# EAGLE schematic xio (EAGLE 9.1.0), part 2 of 2
## Sheet 16 of 16: FPGA Bank3
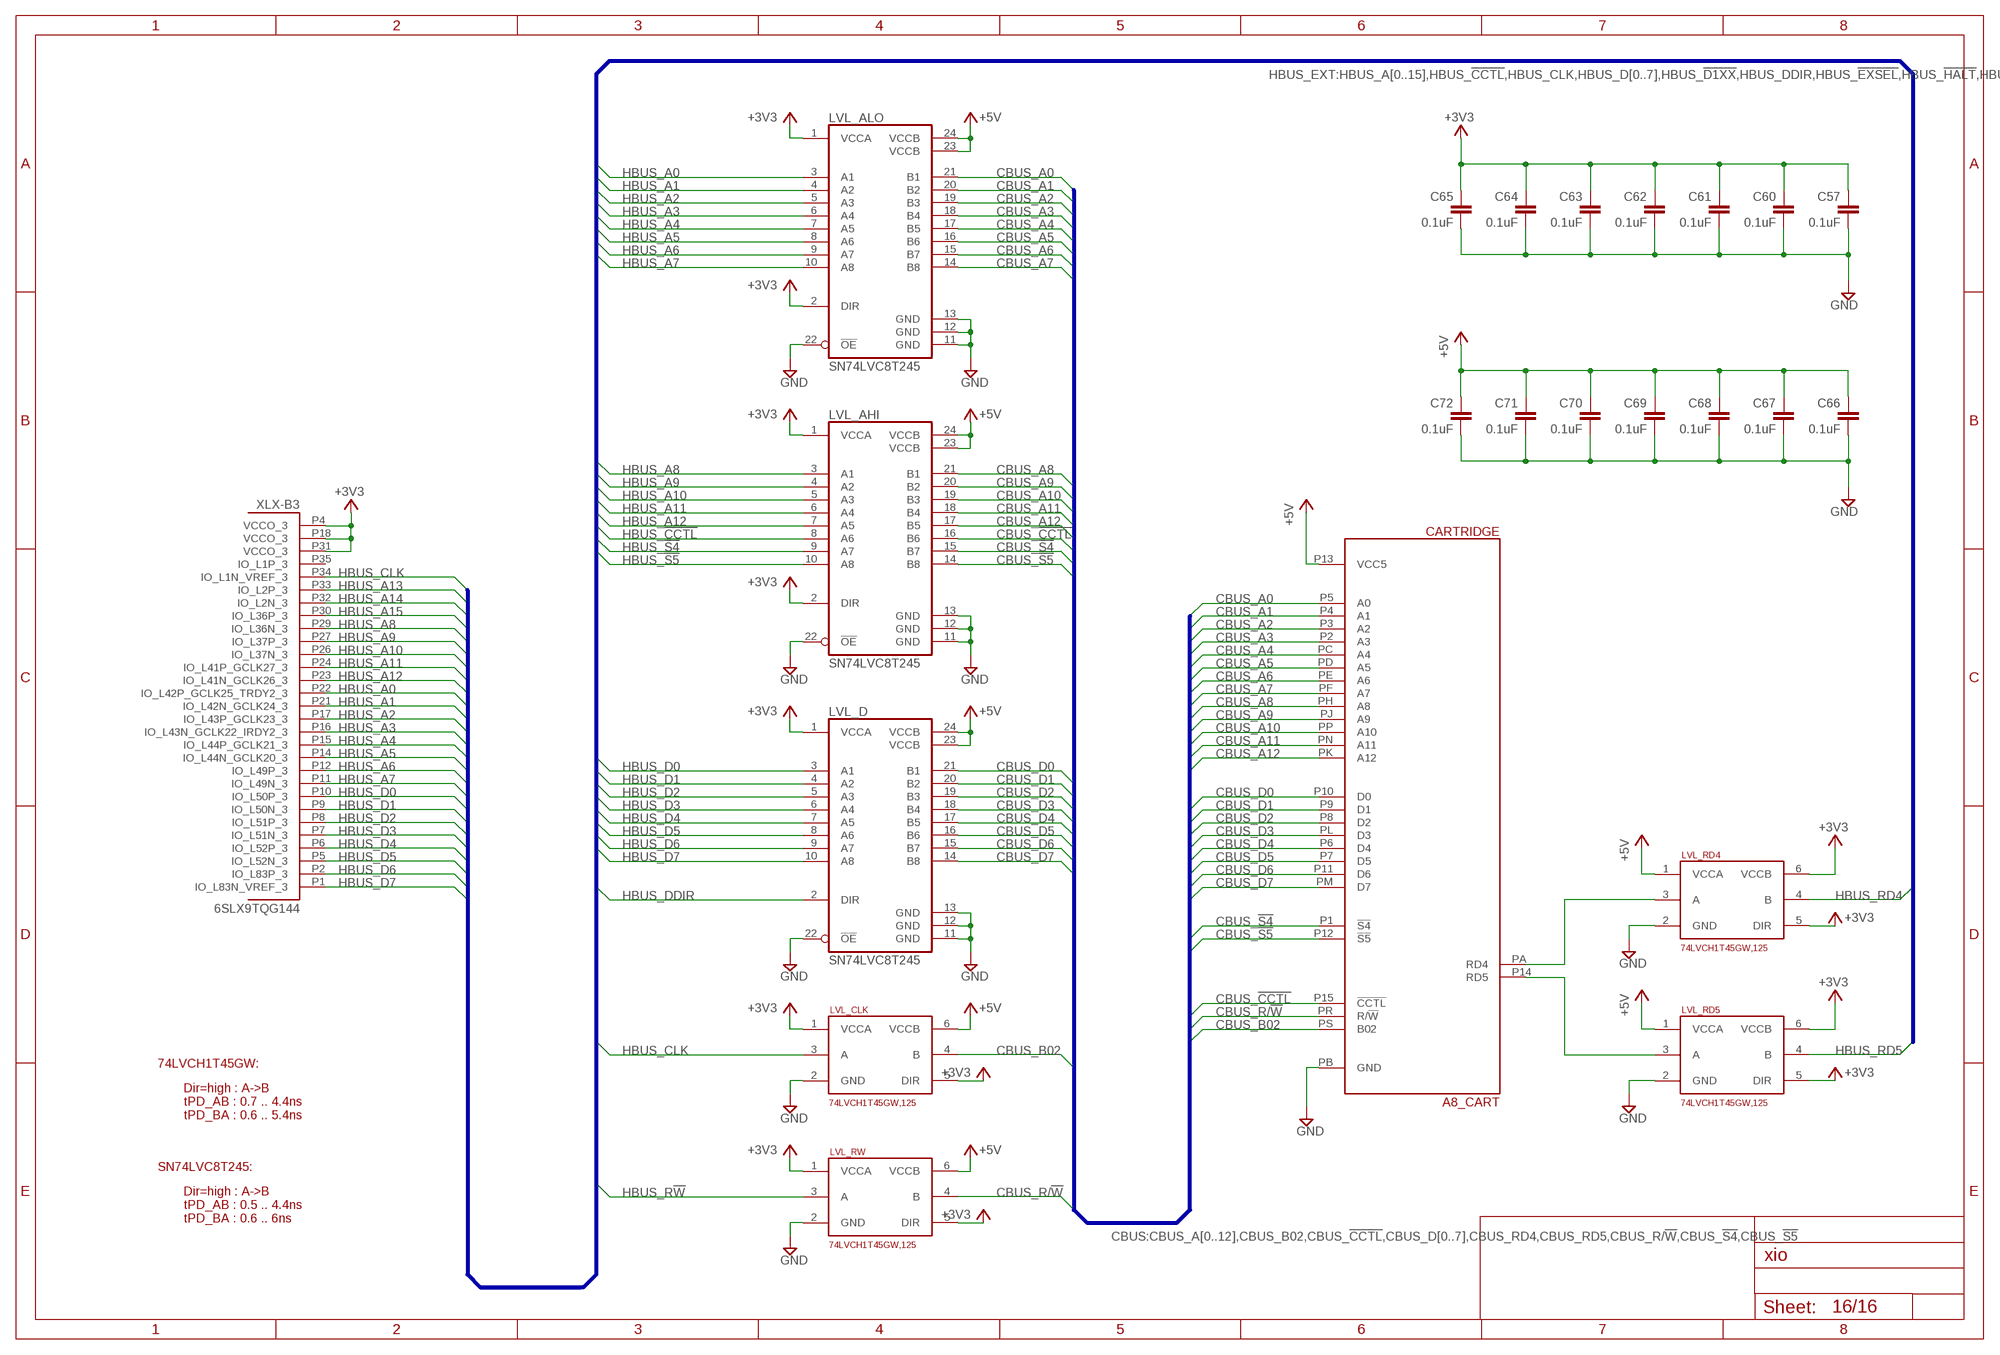
[diagram p18: schematic, sheet 16]

### Parts
C57  0.1uF  C-EUC0402K  [C0402K]
C60  0.1uF  C-EUC0402K  [C0402K]
C61  0.1uF  C-EUC0402K  [C0402K]
C62  0.1uF  C-EUC0402K  [C0402K]
C63  0.1uF  C-EUC0402K  [C0402K]
C64  0.1uF  C-EUC0402K  [C0402K]
C65  0.1uF  C-EUC0402K  [C0402K]
C66  0.1uF  C-EUC0402K  [C0402K]
C67  0.1uF  C-EUC0402K  [C0402K]
C68  0.1uF  C-EUC0402K  [C0402K]
C69  0.1uF  C-EUC0402K  [C0402K]
C70  0.1uF  C-EUC0402K  [C0402K]
C71  0.1uF  C-EUC0402K  [C0402K]
C72  0.1uF  C-EUC0402K  [C0402K]
CARTRIDGE  A8_CART  [A8_CART]
LVL_AHI  SN74LVC8T245  [TSSOP24]
LVL_ALO  SN74LVC8T245  [TSSOP24]
LVL_CLK  74LVCH1T45GW,125  74LVC1T45GW,125  [SOT363]
LVL_D  SN74LVC8T245  [TSSOP24]
LVL_RD4  74LVCH1T45GW,125  74LVC1T45GW,125  [SOT363]
LVL_RD5  74LVCH1T45GW,125  74LVC1T45GW,125  [SOT363]
LVL_RW  74LVCH1T45GW,125  74LVC1T45GW,125  [SOT363]

### Nets
+3V3 [3v3]: C57.1 C60.1 C61.1 C62.1 C63.1 C64.1 C65.1 LVL_AHI.1(VCCA) LVL_AHI.2(DIR) LVL_ALO.1(VCCA) LVL_ALO.2(DIR) LVL_CLK.1(VCCA) LVL_CLK.5(DIR) LVL_D.1(VCCA) LVL_RD4.5(DIR) LVL_RD4.6(VCCB) LVL_RD5.5(DIR) LVL_RD5.6(VCCB) LVL_RW.1(VCCA) LVL_RW.5(DIR) XLX-.P4(B3:VCCO_3) XLX-.P18(B3:VCCO_3) XLX-.P31(B3:VCCO_3) ; also sheet 2,4,5,6,11,12,13,14,15
+5V: C66.1 C67.1 C68.1 C69.1 C70.1 C71.1 C72.1 CARTRIDGE.P13(VCC5) LVL_AHI.23(VCCB) LVL_AHI.24(VCCB) LVL_ALO.23(VCCB) LVL_ALO.24(VCCB) LVL_CLK.6(VCCB) LVL_D.23(VCCB) LVL_D.24(VCCB) LVL_RD4.1(VCCA) LVL_RD5.1(VCCA) LVL_RW.6(VCCB) ; also sheet 2,7,8,9,10,11
CBUS_!CCTL!: CARTRIDGE.P15(!CCTL!) LVL_AHI.16(B6)
CBUS_!S4!: CARTRIDGE.P1(!S4!) LVL_AHI.15(B7)
CBUS_!S5!: CARTRIDGE.P12(!S5!) LVL_AHI.14(B8)
CBUS_A0: CARTRIDGE.P5(A0) LVL_ALO.21(B1)
CBUS_A1: CARTRIDGE.P4(A1) LVL_ALO.20(B2)
CBUS_A2: CARTRIDGE.P3(A2) LVL_ALO.19(B3)
CBUS_A3: CARTRIDGE.P2(A3) LVL_ALO.18(B4)
CBUS_A4: CARTRIDGE.PC(A4) LVL_ALO.17(B5)
CBUS_A5: CARTRIDGE.PD(A5) LVL_ALO.16(B6)
CBUS_A6: CARTRIDGE.PE(A6) LVL_ALO.15(B7)
CBUS_A7: CARTRIDGE.PF(A7) LVL_ALO.14(B8)
CBUS_A8: CARTRIDGE.PH(A8) LVL_AHI.21(B1)
CBUS_A9: CARTRIDGE.PJ(A9) LVL_AHI.20(B2)
CBUS_A10: CARTRIDGE.PP(A10) LVL_AHI.19(B3)
CBUS_A11: CARTRIDGE.PN(A11) LVL_AHI.18(B4)
CBUS_A12: CARTRIDGE.PK(A12) LVL_AHI.17(B5)
CBUS_B02: CARTRIDGE.PS(B02) LVL_CLK.4(B)
CBUS_D0: CARTRIDGE.P10(D0) LVL_D.21(B1)
CBUS_D1: CARTRIDGE.P9(D1) LVL_D.20(B2)
CBUS_D2: CARTRIDGE.P8(D2) LVL_D.19(B3)
CBUS_D3: CARTRIDGE.PL(D3) LVL_D.18(B4)
CBUS_D4: CARTRIDGE.P6(D4) LVL_D.17(B5)
CBUS_D5: CARTRIDGE.P7(D5) LVL_D.16(B6)
CBUS_D6: CARTRIDGE.P11(D6) LVL_D.15(B7)
CBUS_D7: CARTRIDGE.PM(D7) LVL_D.14(B8)
CBUS_R/!W!: CARTRIDGE.PR(R/!W!) LVL_RW.4(B)
GND: C57.2 C60.2 C61.2 C62.2 C63.2 C64.2 C65.2 C66.2 C67.2 C68.2 C69.2 C70.2 C71.2 C72.2 CARTRIDGE.PB(GND) LVL_AHI.11(GND) LVL_AHI.12(GND) LVL_AHI.13(GND) LVL_AHI.22(!OE!) LVL_ALO.11(GND) LVL_ALO.12(GND) LVL_ALO.13(GND) LVL_ALO.22(!OE!) LVL_CLK.2(GND) LVL_D.11(GND) LVL_D.12(GND) LVL_D.13(GND) LVL_D.22(!OE!) LVL_RD4.2(GND) LVL_RD5.2(GND) LVL_RW.2(GND) ; also sheet 2,4,5,6,7,8,9,10,11,12,13,14,15
HBUS_!CCTL!: LVL_AHI.8(A6) ; also sheet 15
HBUS_!S4!: LVL_AHI.9(A7) ; also sheet 15
HBUS_!S5!: LVL_AHI.10(A8) ; also sheet 15
HBUS_A0: LVL_ALO.3(A1) XLX-.P22(B3:IO_L42P_GCLK25_TRDY2_3) ; also sheet 8,9,10
HBUS_A1: LVL_ALO.4(A2) XLX-.P21(B3:IO_L42N_GCLK24_3) ; also sheet 8,9,10
HBUS_A2: LVL_ALO.5(A3) XLX-.P17(B3:IO_L43P_GCLK23_3) ; also sheet 8,9,10
HBUS_A3: LVL_ALO.6(A4) XLX-.P16(B3:IO_L43N_GCLK22_IRDY2_3) ; also sheet 8,9,10
HBUS_A4: LVL_ALO.7(A5) XLX-.P15(B3:IO_L44P_GCLK21_3) ; also sheet 8,9,10
HBUS_A5: LVL_ALO.8(A6) XLX-.P14(B3:IO_L44N_GCLK20_3) ; also sheet 8,9,10
HBUS_A6: LVL_ALO.9(A7) XLX-.P12(B3:IO_L49P_3) ; also sheet 8,9,10
HBUS_A7: LVL_ALO.10(A8) XLX-.P11(B3:IO_L49N_3) ; also sheet 8,9,10
HBUS_A8: LVL_AHI.3(A1) XLX-.P29(B3:IO_L36N_3) ; also sheet 8,9,10
HBUS_A9: LVL_AHI.4(A2) XLX-.P27(B3:IO_L37P_3) ; also sheet 8,9,10
HBUS_A10: LVL_AHI.5(A3) XLX-.P26(B3:IO_L37N_3) ; also sheet 8,9,10
HBUS_A11: LVL_AHI.6(A4) XLX-.P24(B3:IO_L41P_GCLK27_3) ; also sheet 8,9,10
HBUS_A12: LVL_AHI.7(A5) XLX-.P23(B3:IO_L41N_GCLK26_3) ; also sheet 8,9,10
HBUS_A13: XLX-.P33(B3:IO_L2P_3) ; also sheet 8,9,10
HBUS_A14: XLX-.P32(B3:IO_L2N_3) ; also sheet 8,9,10
HBUS_A15: XLX-.P30(B3:IO_L36P_3) ; also sheet 8,9,10
HBUS_CLK: LVL_CLK.3(A) XLX-.P34(B3:IO_L1N_VREF_3) ; also sheet 8,9,10
HBUS_D0: LVL_D.3(A1) XLX-.P10(B3:IO_L50P_3) ; also sheet 8,9,10
HBUS_D1: LVL_D.4(A2) XLX-.P9(B3:IO_L50N_3) ; also sheet 8,9,10
HBUS_D2: LVL_D.5(A3) XLX-.P8(B3:IO_L51P_3) ; also sheet 8,9,10
HBUS_D3: LVL_D.6(A4) XLX-.P7(B3:IO_L51N_3) ; also sheet 8,9,10
HBUS_D4: LVL_D.7(A5) XLX-.P6(B3:IO_L52P_3) ; also sheet 8,9,10
HBUS_D5: LVL_D.8(A6) XLX-.P5(B3:IO_L52N_3) ; also sheet 8,9,10
HBUS_D6: LVL_D.9(A7) XLX-.P2(B3:IO_L83P_3) ; also sheet 8,9,10
HBUS_D7: LVL_D.10(A8) XLX-.P1(B3:IO_L83N_VREF_3) ; also sheet 8,9,10
HBUS_DDIR: LVL_D.2(DIR) ; also sheet 14
HBUS_R!W!: LVL_RW.3(A) ; also sheet 8,9,10,15
HBUS_RD4: LVL_RD4.4(B) ; also sheet 8,9,10,15
HBUS_RD5: LVL_RD5.4(B) ; also sheet 8,9,10,15
N$58: CARTRIDGE.PA(RD4) LVL_RD4.3(A)
N$59: CARTRIDGE.P14(RD5) LVL_RD5.3(A)
Unconnected: XLX-.P35(B3:IO_L1P_3)

### Buses
HBUS_EXT:HBUS_A[0..15],HBUS_!CCTL!,HBUS_CLK,HBUS_D[0..7],HBUS_!D1XX!,HBUS_DDIR,HBUS_!EXSEL!,HBUS_!HALT!,HBUS_!IRQ!,HBUS_!MPD!,HBUS_RD[4..5],HBUS_!REF!,HBUS_!RST!,HBUS_R!W!,HBUS_!S4!,HBUS_!S5!,HBUS_SIO_CLK,HBUS_SIO_CMD,HBUS_SIO_DIN,HBUS_SIO_DOUT,HBUS_SIO_MTR
CBUS:CBUS_A[0..12],CBUS_B02,CBUS_!CCTL!,CBUS_D[0..7],CBUS_RD4,CBUS_RD5,CBUS_R/!W!,CBUS_!S4!,CBUS_!S5!

### Notes on the sheet
- 74LVCH1T45GW:
- Dir=high : A->B
  tPD_AB : 0.7 .. 4.4ns
  tPD_BA : 0.6 .. 5.4ns
- SN74LVC8T245:
- Dir=high : A->B
  tPD_AB : 0.5 .. 4.4ns
  tPD_BA : 0.6 .. 6ns

## Library data of the parts
A_MUX = sjg-logic:TS3A27518E
ARCH_ID = special:SW_DIP-4: DIP SWITCH
AUX-SIO = pinhead:PINHD-1X6: PIN HEADER
C1-C98 C134-C137 C167-C175 C177 = rcl:C-EU: CAPACITOR, European symbol; SPICEPREFIX: C
CARTRIDGE = sjg-con:A8_CART
D1-D5 = diode:BAT54S: Schottky Diodes Pin connection corrected 2011-05-04 Source: Fairchild .. BAT54.pdf
DBG0 DBG1 DBG2 FPGA_DONE = microbuilder:LED: LED 0603 - 0603 Surface Mount Package 2mA: Green LED - Low Power (3.9mcd, 2ma, 1.7Vf) - Digikey: 475-2709-2-ND Orange LED - Low Power (9.8mcd, 2ma, 1.8Vf) - Digikey: 475-1194-2-ND Red LED - Low Power (5mcd, 2ma, 1.8Vf) - Digikey: 475-1195-2-ND Yellow LED - Low Power (7mcd, 2ma, 1.8Vf) - Digikey: 475-1196-2-ND 5mA: Blue LED - Low Power (17mcd, 5ma, 2.9Vf) - Digikey: LNJ937W8CRACT-ND 0805 - 0805 Surface Mount Package 2mA: Red LED (8.8mcd, 2mA, 1.8Vf, Clear) - Low Power [Digikey: 475-2510-1-ND] Green LED (5mcd, 2mA, 1.8Vf, Clear) - Low Power [Digikey: 475-2730-1-ND] Yellow LED (11.3mcd, 2mA, 1.8Vf, Clear) - Low Power [Digikey: 475-2555-1-ND] 20mA: Red LED (104mcd, 20mA, Diffused) - LS R976 [Digikey: 475-1278-6-ND] Red LED (12mcd, 20mA, 2.0Vf, Clear) - APT2012EC [Digikey: 754-1128-1-ND] Green LED (15mcd, 20mA, 2.2Vf, Clear) - APT2012GC [Digikey: 754-1131-1-ND] Orange LED (160mcd, 20mA, 2.1Vf, Clear) - APT2012SECK [Digikey: 754-1130-1-ND] 1206 - 1206 Surface Mount Package Green LED (26mcd, 20mA, Diffused) - LG N971 [Digikey: 475-1407-6-ND] Red LED (15mcd, 20mA, Diffused) - LH N974 [Digikey: 475-1416-6-ND]
FPGA_CFG = microbuilder:SPIFLASH_SOIC8: SOIC8 SPI Flash Be careful with the size since SOIC8 flash comes in several 'widths' SOIC8 150 mil M25P16 - 16Mbit (2Mbit x 8) Serial Flash (75MHz SPI Bus), Supply: 2.7-3.6V Digikey: SOIC8 - M25P16-VMN6P-ND SOIC8 208 mil W25Q16BVSSIG - 16Mbit (2Mbit x 8) Serial Flash (104MHz SPI Bus), Supply: 2.7-3.6V Digikey: SOIC8 - W25Q16BVSSIG-ND
FPGA_PROG = sjg-con:XILINX-JTAG
H1 H2 H4 H5 = holes:MOUNT-HOLE: MOUNTING HOLE with drill center marker
J1 = usb-c:12401598E4#2A: Usb Jack 3.1, C Type, 24 Pin, Ho; AVAILABILITY: Unavailable; DESCRIPTION: Usb Type C / Tape & Reel; MF: Amphenol Commercial; MP: 12401598E4#2A; PACKAGE: None; PRICE: None
JP1 = pinhead:PINHD-2X8: PIN HEADER
JP2 = pinhead:PINHD-2X7: PIN HEADER
LVL_AHI LVL_ALO LVL_D = sjg-logic:SN74LVC8T245
LVL_CLK LVL_RD4 LVL_RD5 LVL_RW = sjg-logic:74LVC1T45GW,125
MEM_ID = special:SW_DIP-2: DIP SWITCH
OSC1 = microbuilder:OSCILLATOR: Oscillators 3.2x2.5mm SMT 4.0MHz +/- 50ppm, 3.3V, 9mA, -40/+85°C - Digikey: 535-9752-1-ND 50MHz +/- 50ppm, 3.3V, 8mA, -10/+70°C - Digikey: 478-4792-1-ND 5x7mm SMT 4.0MHz +/-20ppm 3.3V, 20mA, -20/+70°C - Digikey: 535-9329-2-ND 50MHz +/- 25ppm 3.3V, 35mA, -40/+85°C - Digikey: 631-1197-1-ND
PID = special:SW_DIP-3: DIP SWITCH
PJ-102AH = adafruit:2.1MMJACK: 2.1mm x 5.5mm THM DC jack with internal switch. Digikey part #PJ-102A, 4UCON part #05537 2.1mm x 5.5mm SMT DC jack with internal switch. Digikey part #PJ-002A-SMT, 4UCON part #03267 By microbuilder.eu & adafruit.com
PSW = sjg-power:NCP380
Q1 Q2 = transistor-small-signal:BSS123: N-CHANNEL MOS FET
R1-R4 R6-R90 = rcl:R-EU_: RESISTOR, European symbol; SPICEPREFIX: R
R5 = rcl:R-EU_: RESISTOR, European symbol; NOSTUFF: TRUE; SPICEPREFIX: R
RESET_XIO RESET_XLX = SparkFun:TAC_SWITCH: Momentary Switch Button commonly used for reset or general input. Spark Fun Electronics SKU : COM-00097
SD_SLOT = j_microsd_molex_5025700893:MICROSD_MOLEX_5025700893: Molex 5025700893 MicroSD Normal Mount SMT Connector
SDRAM = sjg-sdram:IS42S32800J
SERIAL0 = SparkFun:DB9: DB9 Connector Standard DB9 (D-Sub 9) serial connector. Can be used for CAN bus as well as RS485 and RS232. Footprint production proven. Spark Fun Electronics SKU : PRT-00429
SERIAL_BUF0 = maxim:MAX3232*: True RS-232 Transceivers 3.0V to 5.5V, Low-Power up to 1Mbps, Using Four 0.1µF External Capacitors Source: http://pdfserv.maxim-ic.com/en/ds/MAX3222-MAX3241.pdf; MPN: MAX3232CSE; OC_FARNELL: 9725490; OC_NEWARK: 90C2890
SLOT0 SLOT1-SLOT4 = pcie:PCIE_64
TP1-TP13 = microbuilder:TESTPOINT: Test Point Various test points for characterisation and PCB testing TESTPOINT_SMT - Compact Surface Mount Test Point [Digikey: 5016KTR-ND]
USB_ESD = sjg-isolation:PUSB2X4YH
V33_0 V33_1-V33_4 VREG33 = sjg-power:AP7363: AP7363 voltage regulator, in +5v, out +1.0v @ 1.5A http://www.digikey.com/product-detail/en/AP7363-10D-13/AP7363-10D-13CT-ND/3829398
VGA = SparkFun-Connectors:DB15: DB15 / VGA right angle through-hole female connector.
VGA_BLU VGA_GRN VGA_RED = sjg-logic:SN74ALVC244
VREG1_2 = sjg-power:LD1117
VREG_MON = sjg-power:TPS3808DBVR
X1 = con-hirose:MINI-USB-: MINI USB Connector Source: http://www.hirose.co.jp/cataloge_hp/e24000019.pdf; OC_FARNELL: unknown; OC_NEWARK: unknown
XIO = sjg-stm32:STM32F429B-XIO: STM32f429 configured as Peripheral IO controller on the expansion bus side of the LxLink bridge
XIO-SWD = sjg-stm32:STM_DEBUG
XLX- = xilinx_devices_V6:6SLX9TQG144: Xilinx FPGA: 6SLX9TQG144
Y2 = microbuilder:CRYSTAL: Crystals HC49UP - Surface Mount Crystal 4.0MHz 18pF +/-30ppm Surface Mount Crystal [Digikey: 535-9857-1-ND] 12.0 MHz Surface Mount Crystal [Digikey: 535-9869-6-ND] 25.0 MHz Surface Mount Crystal [Digikey: 535-9078-1-ND] 2.5 x 2.0mm - MEMs SMT Crystal 16.0 MHz 10pF 20ppm 2.5 x 2.0mm Crystal [Digikey -40-85°C: 535-10923-1-ND] 3.2 x 2.5mm - MEMs SMT Crystal 12.0 MHz 8pF 15ppm 3.2 x 2.5mm Crystal [Digikey: -10-70°C: 644-1047-1-ND -40-125°C: 644-1128-1-ND] 16.0 MHz 8pF 15ppm 3.2 x 2.5mm Crystal [Digikey: -10-70°C: 644-1049-1-ND -40-125°C: 644-1129-2-ND] 16.0 MHz 10pF 10ppm 3.2 x 2.5mm Crystal [Digikey: 644-1100-1-ND] 27.12 MHz 18pF 30ppm 3.2 x 2.5mm Crystal [Digikey: 887-1424-1-ND] 27.12MHz 10pF 10ppm 3.2 x 2.5mm Crystal [Digikey: 887-1329-1-ND] 4.9 x 1.8mm - MEMs SMT Crystal 32.768 KHz 12.5pF 20ppm 4.9 x 1.8mm Crystal [Digikey: SE2415CT-ND] 8.0 x 3.8mm - Surface Mount Crystal 32.768kHz 12.5pF 20ppm -40°C-85°C [Digikey: 535-9166-2-ND] Cylinder 32.768KHz Cylinder Crystal (2x6mm body) [Ex. Digikey: 300-8341-2-ND]

## Net classes
1 Power: width 0.305 mm, drill 0.203 mm
2 Slot-power: width 0.508 mm
3 tx100: width 0.254 mm, clearance 0.457 mm
4 usb90: width 0.254 mm, clearance 0.178 mm
5 cclk50: width 0.203 mm
6 3v3: width 0.254 mm